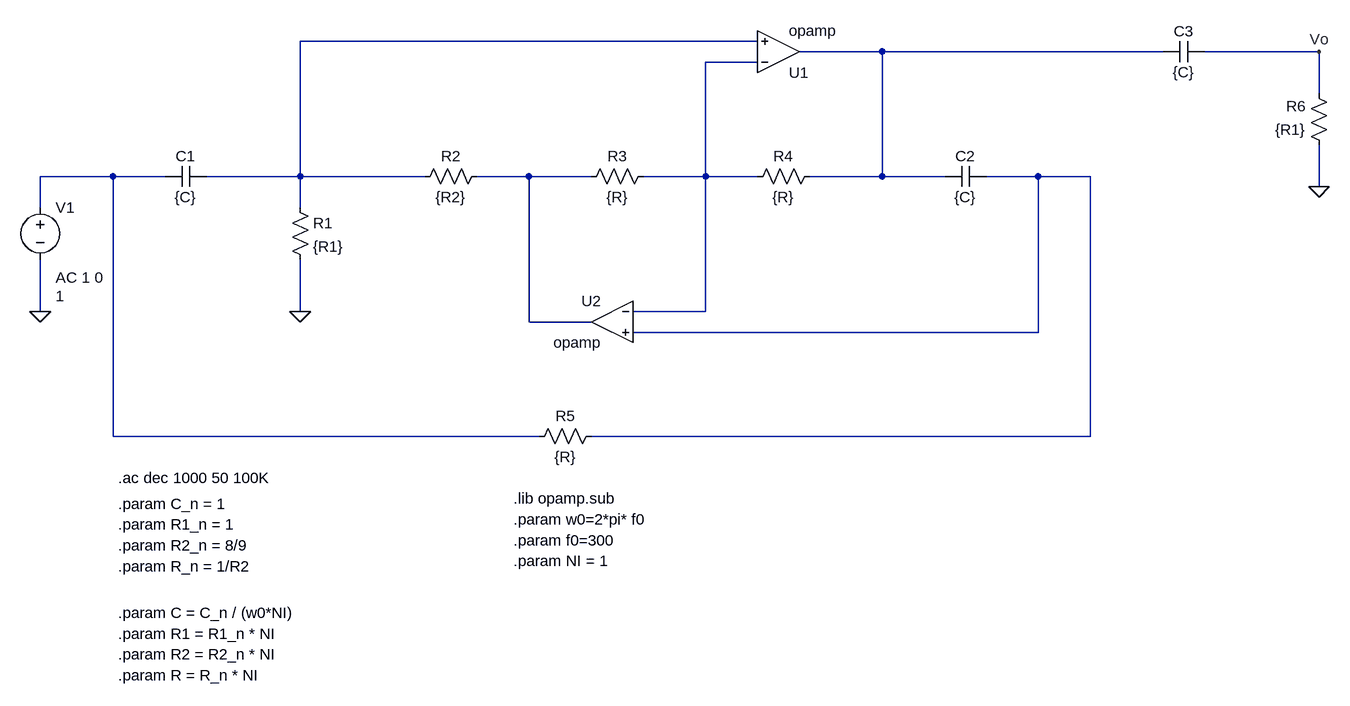
[diagram p0: schematic TS5.asc]
TS5.asc, the LTspice schematic file:
Version 4
SHEET 1 1944 912
WIRE 528 -80 -176 -80
WIRE 720 -64 592 -64
WIRE 1152 -64 720 -64
WIRE 1392 -64 1216 -64
WIRE 528 -48 448 -48
WIRE 1392 0 1392 -64
WIRE -464 128 -576 128
WIRE -384 128 -464 128
WIRE -176 128 -176 -80
WIRE -176 128 -320 128
WIRE 16 128 -176 128
WIRE 176 128 96 128
WIRE 272 128 176 128
WIRE 448 128 448 -48
WIRE 448 128 352 128
WIRE 528 128 448 128
WIRE 720 128 720 -64
WIRE 720 128 608 128
WIRE 816 128 720 128
WIRE 960 128 880 128
WIRE 1040 128 960 128
WIRE 1392 144 1392 80
WIRE -576 176 -576 128
WIRE -176 176 -176 128
WIRE -576 336 -576 256
WIRE -176 336 -176 256
WIRE 448 336 448 128
WIRE 448 336 336 336
WIRE 176 352 176 128
WIRE 272 352 176 352
WIRE 960 368 960 128
WIRE 960 368 336 368
WIRE -464 528 -464 128
WIRE 192 528 -464 528
WIRE 1040 528 1040 128
WIRE 1040 528 272 528
FLAG -176 336 0
FLAG -576 336 0
FLAG 1392 144 0
FLAG 1392 -64 Vo
SYMBOL cap -320 112 R90
WINDOW 0 0 32 VBottom 2
WINDOW 3 32 32 VTop 2
SYMATTR InstName C1
SYMATTR Value {C}
SYMBOL res -192 160 R0
SYMATTR InstName R1
SYMATTR Value {R1}
SYMBOL res 112 112 R90
WINDOW 0 0 56 VBottom 2
WINDOW 3 32 56 VTop 2
SYMATTR InstName R2
SYMATTR Value {R2}
SYMBOL res 368 112 R90
WINDOW 0 0 56 VBottom 2
WINDOW 3 32 56 VTop 2
SYMATTR InstName R3
SYMATTR Value {R}
SYMBOL res 624 112 R90
WINDOW 0 0 56 VBottom 2
WINDOW 3 32 56 VTop 2
SYMATTR InstName R4
SYMATTR Value {R}
SYMBOL res 288 512 R90
WINDOW 0 0 56 VBottom 2
WINDOW 3 32 56 VTop 2
SYMATTR InstName R5
SYMATTR Value {R}
SYMBOL cap 880 112 R90
WINDOW 0 0 32 VBottom 2
WINDOW 3 32 32 VTop 2
SYMATTR InstName C2
SYMATTR Value {C}
SYMBOL OpAmps\\opamp 560 0 M180
SYMATTR InstName U1
SYMBOL OpAmps\\opamp 304 288 M0
SYMATTR InstName U2
SYMBOL voltage -576 160 R0
WINDOW 3 24 152 Left 2
WINDOW 123 24 124 Left 2
WINDOW 39 0 0 Left 0
SYMATTR Value 1
SYMATTR Value2 AC 1 0
SYMATTR InstName V1
SYMBOL res 1408 96 R180
WINDOW 0 36 76 Left 2
WINDOW 3 36 40 Left 2
SYMATTR InstName R6
SYMATTR Value {R1}
SYMBOL cap 1216 -80 R90
WINDOW 0 0 32 VBottom 2
WINDOW 3 32 32 VTop 2
SYMATTR InstName C3
SYMATTR Value {C}
TEXT 152 624 Left 2 !.lib opamp.sub
TEXT -456 800 Left 2 !.param C = C_n / (w0*NI)
TEXT -456 832 Left 2 !.param R1 = R1_n * NI
TEXT -456 864 Left 2 !.param R2 = R2_n * NI
TEXT -456 592 Left 2 !.ac dec 1000 50 100K
TEXT 152 656 Left 2 !.param w0=2*pi* f0
TEXT 152 688 Left 2 !.param f0=300
TEXT -456 896 Left 2 !.param R = R_n * NI
TEXT -456 632 Left 2 !.param C_n = 1
TEXT 152 720 Left 2 !.param NI = 1
TEXT -456 664 Left 2 !.param R1_n = 1
TEXT -456 696 Left 2 !.param R2_n = 8/9
TEXT -456 728 Left 2 !.param R_n = 1/R2

The netlist it stands for:
* TS5.asc
C1 N001 N004 {C}
R1 N001 0 {R1}
R2 N005 N001 {R2}
R3 N003 N005 {R}
R4 N002 N003 {R}
R5 N006 N004 {R}
C2 N006 N002 {C}
XU1 N003 N001 N002 opamp Aol=100K GBW=10Meg  ; pins invin noninvin out
XU2 N003 N006 N005 opamp Aol=100K GBW=10Meg  ; pins invin noninvin out
V1 N004 0 1 AC 1 0
R6 0 Vo {R1}
C3 Vo N002 {C}
.lib opamp.sub
.param C = C_n / (w0*NI)
.param R1 = R1_n * NI
.param R2 = R2_n * NI
.ac dec 1000 50 100K
.param w0=2*pi* f0
.param f0=300
.param R = R_n * NI
.param C_n = 1
.param NI = 1
.param R1_n = 1
.param R2_n = 8/9
.param R_n = 1/R2
.backanno
.end